# Altium project DC-Ansteuerung.PrjPcb
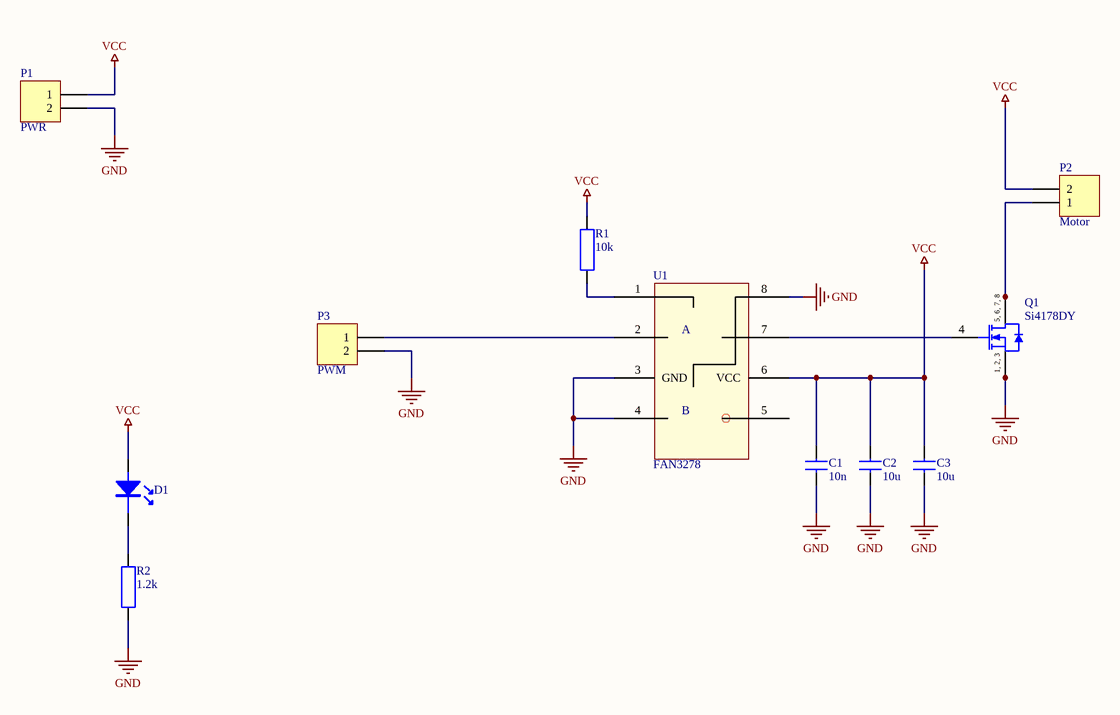
[diagram p0: Schema.SchDoc]
1 sheet, 11 parts. Net scope: global (net labels, ports and power ports of the same name join across sheets).
Board file: Layout.PcbDoc

## Sheet Schema.SchDoc
size A4

### Parts
C1  10n  [0805]
C2  10u  [1206]
C3  10u  [1206]
D1  LED  [0805]  (value not drawn)
P1  PWR  [Stecker_1x2_200mil]
P2  Motor  [Stecker_1x2_200mil]
P3  PWM  [HDR1X2]
Q1  Si4178DY  [SO-8_L]
R1  10k  [0805]
R2  1.2k  [0805]
U1  FAN3278  [SO-8_L]

### Nets
GND: C1.2 C2.2 C3.2 P1.2 P3.2 Q1.1(S) Q1.2(S) Q1.3(S) R2.1 U1.3(GND) U1.4 U1.8
VCC: C1.1 C2.1 C3.1 D1.2 P1.1 P2.2 R1.2 U1.6(VCC)
NetD1_1: D1.1 R2.2
NetP2_1: P2.1 Q1.5(D) Q1.6(D) Q1.7(D) Q1.8(D)
NetP3_1: P3.1 U1.2
NetQ1_4: Q1.4(G) U1.7
NetR1_1: R1.1 U1.1

Not connected (* = marked no-connect by the designer): U1 5

### Notes on the sheet
- (in symbol FAN3278) A; B
- (in symbol SI4412DY) 5, 6, 7, 8; 1, 2, 3

### Library data of the parts
C1-C3 = C?: Normaler Kondensator
P1-P3 = Header 2: Header, 2-Pin; LatestRevisionDate: 17-Jul-2002; LatestRevisionNote: Re-released for DXP Platform.; Publisher: Altium Limited
Q1 = SI4412DY: N-Channel 30V (D-S)  Rated MOSFET; Published: 8-Jun-2000; LatestRevisionDate: 13-Apr-2006; LatestRevisionNote: IPC-7351 Footprint Added.; DatasheetVersion: 6-Oct-1997; PackageVersion: Aug-1998; PackageReference: SO-8; Publisher: Altium Limited; PackageDescription: 8-Pin Small Outline Integrated Circuit 1.27 mm Pitch; ComponentLink1Description: Manufacturer Link; ComponentLink1URL: http://www.vishay.com/; ComponentLink2Description: Datasheet; ComponentLink2URL: http://www.vishay.com/docs/70154/70154.pdf
R1 R2 = R?: Normaler Widerstand